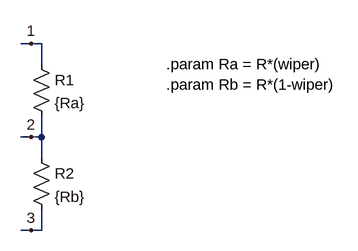
[diagram p0: schematic varres.asc]
varres.asc, the LTspice schematic file:
Version 4
SHEET 1 892 680
WIRE 368 144 352 144
WIRE 384 144 368 144
WIRE 384 176 384 144
WIRE 368 288 352 288
WIRE 384 288 384 256
WIRE 384 288 368 288
WIRE 384 320 384 288
WIRE 368 432 352 432
WIRE 384 432 384 400
WIRE 384 432 368 432
FLAG 368 144 1
FLAG 368 288 2
FLAG 368 432 3
SYMBOL res 368 160 R0
SYMATTR InstName R1
SYMATTR Value {Ra}
SYMBOL res 368 304 R0
SYMATTR InstName R2
SYMATTR Value {Rb}
TEXT 576 176 Left 2 !.param Ra = R*(wiper)\n.param Rb = R*(1-wiper)

The netlist it stands for:
* varres.asc
R1 1 2 {Ra}
R2 2 3 {Rb}
.param Ra = R*(wiper)
.param Rb = R*(1-wiper)
.backanno
.end